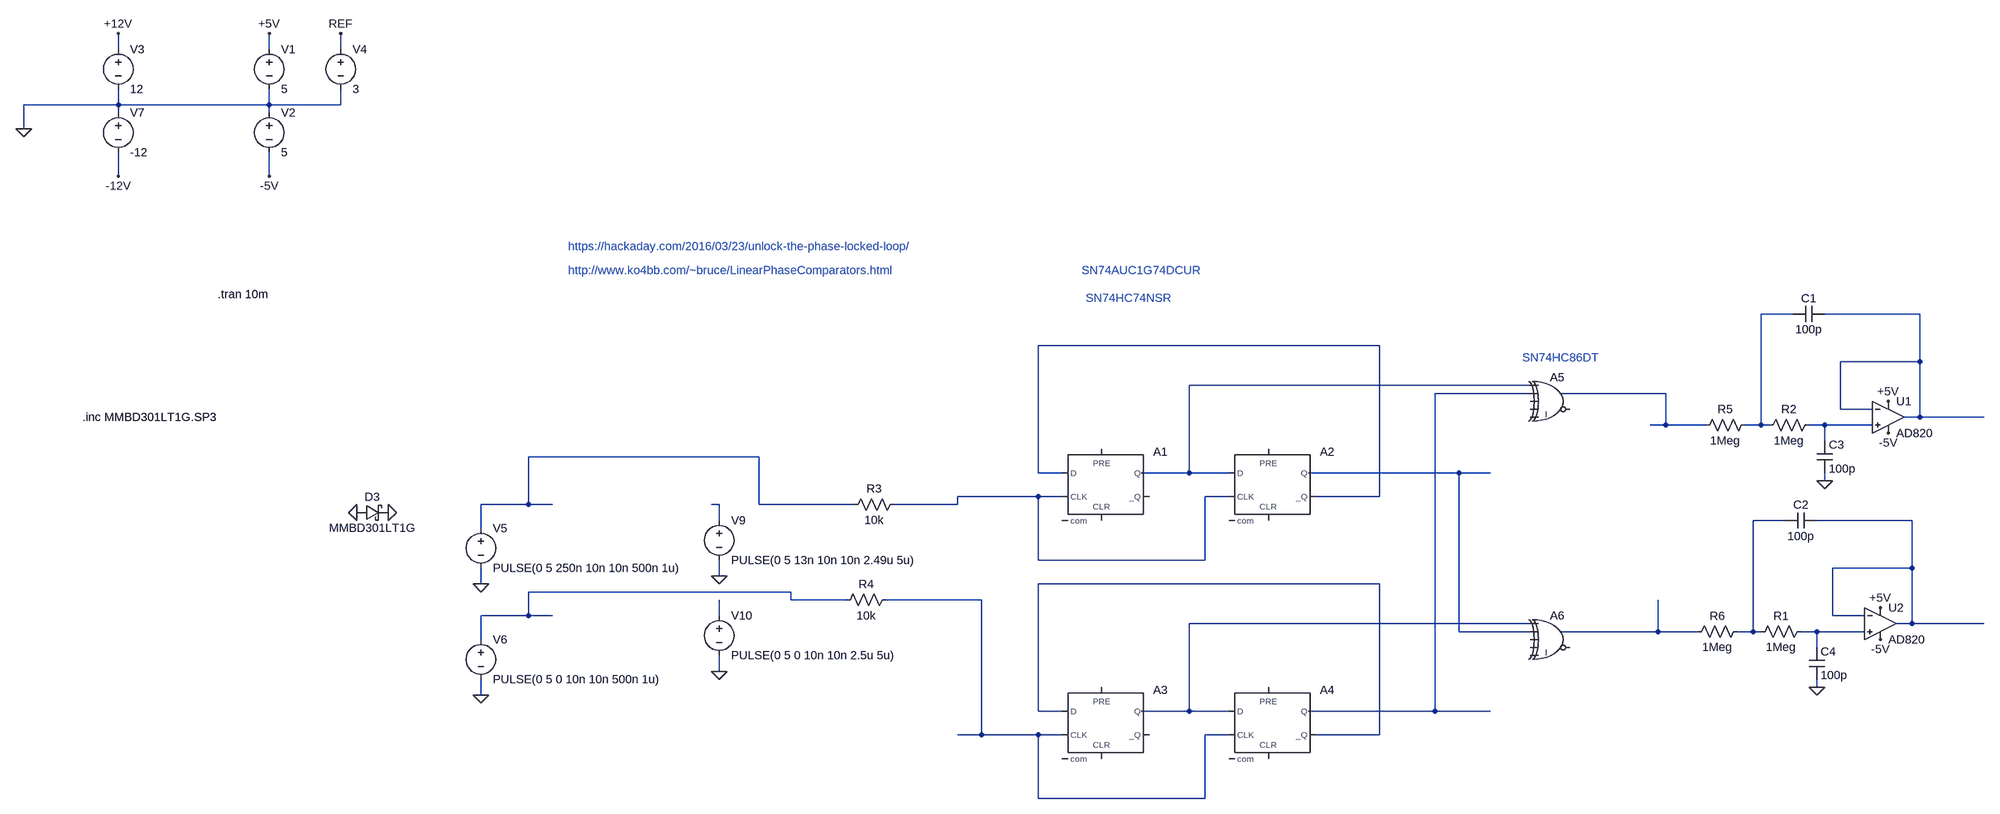
[diagram p0: schematic phase_detector_2.asc]
phase_detector_2.asc, the LTspice schematic file:
Version 4
SHEET 1 4840 2148
WIRE -464 -128 -464 -160
WIRE -160 -128 -160 -160
WIRE -16 -128 -16 -160
WIRE -464 -16 -464 -48
WIRE -464 -16 -736 -16
WIRE -160 -16 -160 -48
WIRE -160 -16 -464 -16
WIRE -16 -16 -16 -48
WIRE -16 -16 -160 -16
WIRE -464 0 -464 -16
WIRE -160 0 -160 -16
WIRE -736 32 -736 -16
WIRE -464 128 -464 80
WIRE -160 128 -160 80
WIRE 3824 592 3760 592
WIRE 4080 592 3888 592
WIRE 2960 656 2272 656
WIRE 4080 688 4080 592
WIRE 4080 688 3920 688
WIRE 3280 736 2576 736
WIRE 3280 752 3088 752
WIRE 3568 752 3344 752
WIRE 3920 784 3920 688
WIRE 3984 784 3920 784
WIRE 4080 800 4080 688
WIRE 4080 800 4048 800
WIRE 4384 800 4080 800
WIRE 3568 816 3568 752
WIRE 3568 816 3536 816
WIRE 3648 816 3568 816
WIRE 3760 816 3760 592
WIRE 3760 816 3728 816
WIRE 3776 816 3760 816
WIRE 3888 816 3856 816
WIRE 3984 816 3888 816
WIRE 3888 848 3888 816
WIRE 1568 880 1104 880
WIRE 2272 912 2272 656
WIRE 2320 912 2272 912
WIRE 2576 912 2576 736
WIRE 2576 912 2480 912
WIRE 2656 912 2576 912
WIRE 3136 912 2816 912
WIRE 3200 912 3136 912
WIRE 3888 928 3888 912
WIRE 2272 960 1968 960
WIRE 2320 960 2272 960
WIRE 2656 960 2608 960
WIRE 2960 960 2960 656
WIRE 2960 960 2832 960
WIRE 1104 976 1104 880
WIRE 1104 976 1008 976
WIRE 1152 976 1104 976
WIRE 1488 976 1472 976
WIRE 1568 976 1568 880
WIRE 1760 976 1568 976
WIRE 1968 976 1968 960
WIRE 1968 976 1840 976
WIRE 1488 1008 1488 976
WIRE 3808 1008 3744 1008
WIRE 4064 1008 3872 1008
WIRE 1008 1024 1008 976
WIRE 2272 1088 2272 960
WIRE 2608 1088 2608 960
WIRE 2608 1088 2272 1088
WIRE 4064 1104 4064 1008
WIRE 4064 1104 3904 1104
WIRE 1488 1120 1488 1088
WIRE 1008 1136 1008 1104
WIRE 2960 1136 2272 1136
WIRE 1632 1152 1104 1152
WIRE 1632 1168 1632 1152
WIRE 1744 1168 1632 1168
WIRE 2016 1168 1824 1168
WIRE 1104 1200 1104 1152
WIRE 1104 1200 1008 1200
WIRE 1152 1200 1104 1200
WIRE 1488 1200 1488 1168
WIRE 3904 1200 3904 1104
WIRE 3968 1200 3904 1200
WIRE 3280 1216 2576 1216
WIRE 4064 1216 4064 1104
WIRE 4064 1216 4032 1216
WIRE 4384 1216 4064 1216
WIRE 3136 1232 3136 912
WIRE 3280 1232 3136 1232
WIRE 3552 1232 3552 1168
WIRE 3552 1232 3344 1232
WIRE 3632 1232 3552 1232
WIRE 3744 1232 3744 1008
WIRE 3744 1232 3712 1232
WIRE 3760 1232 3744 1232
WIRE 3872 1232 3840 1232
WIRE 3968 1232 3872 1232
WIRE 1008 1248 1008 1200
WIRE 3872 1264 3872 1232
WIRE 1488 1312 1488 1280
WIRE 3872 1344 3872 1328
WIRE 1008 1360 1008 1328
WIRE 2272 1392 2272 1136
WIRE 2320 1392 2272 1392
WIRE 2576 1392 2576 1216
WIRE 2576 1392 2480 1392
WIRE 2656 1392 2576 1392
WIRE 3088 1392 3088 752
WIRE 3088 1392 2816 1392
WIRE 3200 1392 3088 1392
WIRE 2016 1440 2016 1168
WIRE 2016 1440 1968 1440
WIRE 2272 1440 2016 1440
WIRE 2320 1440 2272 1440
WIRE 2656 1440 2608 1440
WIRE 2960 1440 2960 1136
WIRE 2960 1440 2832 1440
WIRE 2272 1568 2272 1440
WIRE 2608 1568 2608 1440
WIRE 2608 1568 2272 1568
FLAG -736 32 0
FLAG -160 -160 +5V
FLAG -160 128 -5V
FLAG -16 -160 REF
FLAG 16 992 0
FLAG 80 992 0
FLAG -464 -160 +12V
FLAG -464 128 -12V
FLAG 1488 1120 0
FLAG 1488 1312 0
FLAG 1008 1136 0
FLAG 1008 1360 0
FLAG 4016 768 +5V
FLAG 4016 832 -5V
FLAG 3888 928 0
FLAG 4000 1184 +5V
FLAG 4000 1248 -5V
FLAG 3872 1344 0
SYMBOL voltage -160 -144 R0
WINDOW 123 0 0 Left 0
WINDOW 39 0 0 Left 0
SYMATTR InstName V1
SYMATTR Value 5
SYMBOL voltage -160 -16 R0
WINDOW 123 0 0 Left 0
WINDOW 39 0 0 Left 0
SYMATTR InstName V2
SYMATTR Value 5
SYMBOL voltage -16 -144 R0
WINDOW 123 0 0 Left 0
WINDOW 39 0 0 Left 0
SYMATTR InstName V4
SYMATTR Value 3
SYMBOL schottky 16 1008 R270
WINDOW 0 32 32 VTop 2
WINDOW 3 0 32 VBottom 2
SYMATTR InstName D3
SYMATTR Value MMBD301LT1G
SYMATTR Description Diode
SYMATTR Type diode
SYMBOL voltage -464 -144 R0
WINDOW 123 0 0 Left 0
WINDOW 39 0 0 Left 0
SYMATTR InstName V3
SYMATTR Value 12
SYMBOL voltage -464 -16 R0
WINDOW 123 0 0 Left 0
WINDOW 39 0 0 Left 0
SYMATTR InstName V7
SYMATTR Value -12
SYMBOL voltage 1488 992 R0
WINDOW 123 0 0 Left 0
WINDOW 39 0 0 Left 0
SYMATTR InstName V9
SYMATTR Value PULSE(0 5 13n 10n 10n 2.49u 5u)
SYMBOL res 1856 960 R90
WINDOW 0 0 56 VBottom 2
WINDOW 3 32 56 VTop 2
SYMATTR InstName R3
SYMATTR Value 10k
SYMBOL res 1840 1152 R90
WINDOW 0 0 56 VBottom 2
WINDOW 3 32 56 VTop 2
SYMATTR InstName R4
SYMATTR Value 10k
SYMBOL voltage 1488 1184 R0
WINDOW 123 0 0 Left 0
WINDOW 39 0 0 Left 0
SYMATTR InstName V10
SYMATTR Value PULSE(0 5 0 10n 10n 2.5u 5u)
SYMBOL Digital\\dflop 2400 864 R0
SYMATTR InstName A1
SYMATTR SpiceLine Vhigh 5 Trise 10n
SYMBOL Digital\\dflop 2736 864 R0
SYMATTR InstName A2
SYMATTR SpiceLine Vhigh 5 Trise 10n
SYMBOL Digital\\dflop 2400 1344 R0
SYMATTR InstName A3
SYMATTR SpiceLine Vhigh 5 Trise 10n
SYMBOL Digital\\dflop 2736 1344 R0
SYMATTR InstName A4
SYMATTR SpiceLine Vhigh 5 Trise 10n
SYMBOL Digital\\xor 3328 704 R0
SYMATTR InstName A5
SYMATTR SpiceLine Vhigh 5 Trise 10n
SYMBOL Digital\\xor 3328 1184 R0
SYMATTR InstName A6
SYMATTR SpiceLine Vhigh 5 Trise 10n
SYMBOL voltage 1008 1008 R0
WINDOW 123 0 0 Left 0
WINDOW 39 0 0 Left 0
SYMATTR InstName V5
SYMATTR Value PULSE(0 5 250n 10n 10n 500n 1u)
SYMBOL voltage 1008 1232 R0
WINDOW 123 0 0 Left 0
WINDOW 39 0 0 Left 0
SYMATTR InstName V6
SYMATTR Value PULSE(0 5 0 10n 10n 500n 1u)
SYMBOL Opamps\\AD820 4016 736 R0
SYMATTR InstName U1
SYMBOL cap 3888 576 R90
WINDOW 0 0 32 VBottom 2
WINDOW 3 32 32 VTop 2
SYMATTR InstName C1
SYMATTR Value 100p
SYMBOL cap 3872 848 R0
SYMATTR InstName C3
SYMATTR Value 100p
SYMBOL res 3872 800 R90
WINDOW 0 0 56 VBottom 2
WINDOW 3 32 56 VTop 2
SYMATTR InstName R2
SYMATTR Value 1Meg
SYMBOL res 3744 800 R90
WINDOW 0 0 56 VBottom 2
WINDOW 3 32 56 VTop 2
SYMATTR InstName R5
SYMATTR Value 1Meg
SYMBOL Opamps\\AD820 4000 1152 R0
SYMATTR InstName U2
SYMBOL cap 3872 992 R90
WINDOW 0 0 32 VBottom 2
WINDOW 3 32 32 VTop 2
SYMATTR InstName C2
SYMATTR Value 100p
SYMBOL cap 3856 1264 R0
SYMATTR InstName C4
SYMATTR Value 100p
SYMBOL res 3856 1216 R90
WINDOW 0 0 56 VBottom 2
WINDOW 3 32 56 VTop 2
SYMATTR InstName R1
SYMATTR Value 1Meg
SYMBOL res 3728 1216 R90
WINDOW 0 0 56 VBottom 2
WINDOW 3 32 56 VTop 2
SYMATTR InstName R6
SYMATTR Value 1Meg
TEXT -264 552 Left 2 !.tran 10m
TEXT -536 800 Left 2 !.inc MMBD301LT1G.SP3
TEXT 1184 456 Left 2 ;https://hackaday.com/2016/03/23/unlock-the-phase-locked-loop/
TEXT 1184 504 Left 2 ;http://www.ko4bb.com/~bruce/LinearPhaseComparators.html
TEXT 2360 504 Left 2 ;SN74AUC1G74DCUR
TEXT 2368 560 Left 2 ;SN74HC74NSR
TEXT 3264 680 Left 2 ;SN74HC86DT

The netlist it stands for:
* phase_detector_2.asc
V1 +5V 0 5
V2 0 -5V 5
V4 REF 0 3
D3 0 0 MMBD301LT1G
V3 +12V 0 12
V7 0 -12V -12
V9 N011 0 PULSE(0 5 13n 10n 10n 2.49u 5u)
R3 N010 N008 10k
R4 N016 N015 10k
V10 N017 0 PULSE(0 5 0 10n 10n 2.5u 5u)
A1 N003 0 N010 0 0 0 N004 0 DFLOP Vhigh 5 Trise 10n
A2 N004 0 N010 0 0 N003 N009 0 DFLOP Vhigh 5 Trise 10n
A3 N014 0 N016 0 0 0 N018 0 DFLOP Vhigh 5 Trise 10n
A4 N018 0 N016 0 0 N014 N005 0 DFLOP Vhigh 5 Trise 10n
A5 N004 N005 0 0 0 0 N006 0 XOR Vhigh 5 Trise 10n
A6 N018 N009 0 0 0 0 N019 0 XOR Vhigh 5 Trise 10n
V5 N008 0 PULSE(0 5 250n 10n 10n 500n 1u)
V6 N015 0 PULSE(0 5 0 10n 10n 500n 1u)
XU1 N007 N002 +5V -5V N002 AD820  ; pins In+ In- V+ V- OUT
C1 N002 N001 100p
C3 N007 0 100p
R2 N007 N001 1Meg
R5 N001 N006 1Meg
XU2 N020 N013 +5V -5V N013 AD820  ; pins In+ In- V+ V- OUT
C2 N013 N012 100p
C4 N020 0 100p
R1 N020 N012 1Meg
R6 N012 N019 1Meg
.model D D
.lib standard.dio
.tran 10m
.inc MMBD301LT1G.SP3
* https://hackaday.com/2016/03/23/unlock-the-phase-locked-loop/
* http://www.ko4bb.com/~bruce/LinearPhaseComparators.html
* SN74AUC1G74DCUR
* SN74HC74NSR
* SN74HC86DT
.backanno
.end